# EAGLE design terminal-r1 (EAGLE 4.16)
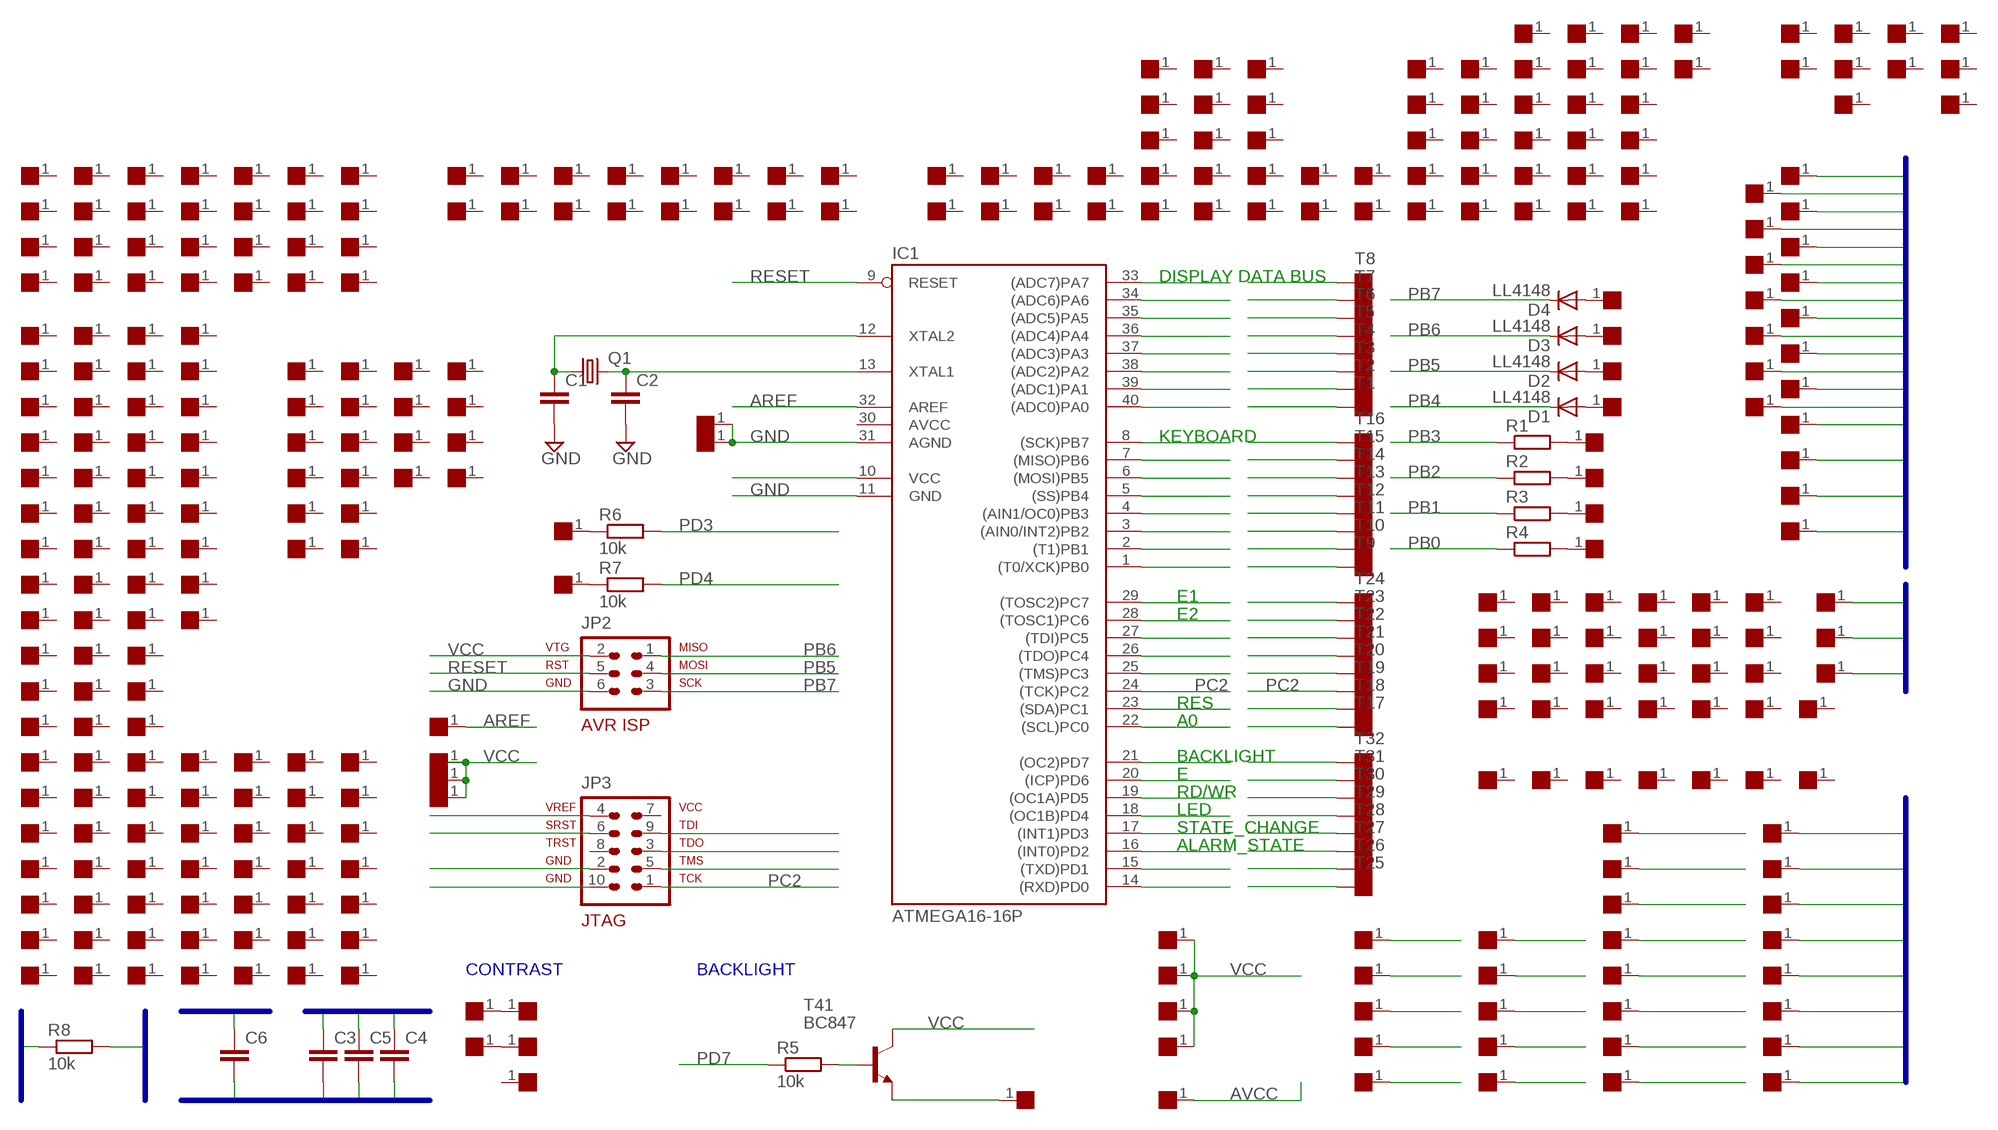
[diagram p0: schematic, sheet 1]

## Parts
C1  C-EUC0805  [C0805]
C2  C-EUC0805  [C0805]
C3  C-EUC1206  [C1206]
C4  C-EUC1210  [C1210]
C5  C-EUC1206  [C1206]
C6  C-EUC1206  [C1206]
D1  LL4148  [MINIMELF]
D2  LL4148  [MINIMELF]
D3  LL4148  [MINIMELF]
D4  LL4148  [MINIMELF]
IC1  ATMEGA16-16P  [DIL40]
JP2  AVR-ISP-6  [AVR-ISP-6]
JP3  AVR-JTAG-10  [AVR-JTAG-10]
Q1  CRYSTALHC49S  [HC49/S]
R1  R-EU_M0805  [M0805]
R2  R-EU_M0805  [M0805]
R3  R-EU_M0805  [M0805]
R4  R-EU_M0805  [M0805]
R5  10k  R-EU_M0805  [M0805]
R6  10k  R-EU_M0805  [M0805]
R7  10k  R-EU_M0805  [M0805]
R8  10k  R-EU_M0805  [M0805]
T1  TESTPOINT  [TESTPOIN]
T2  TESTPOINT  [TESTPOIN]
T3  TESTPOINT  [TESTPOIN]
T4  TESTPOINT  [TESTPOIN]
T5  TESTPOINT  [TESTPOIN]
T6  TESTPOINT  [TESTPOIN]
T7  TESTPOINT  [TESTPOIN]
T8  TESTPOINT  [TESTPOIN]
T9  TESTPOINT  [TESTPOIN]
T10  TESTPOINT  [TESTPOIN]
T11  TESTPOINT  [TESTPOIN]
T12  TESTPOINT  [TESTPOIN]
T13  TESTPOINT  [TESTPOIN]
T14  TESTPOINT  [TESTPOIN]
T15  TESTPOINT  [TESTPOIN]
T16  TESTPOINT  [TESTPOIN]
T17  TESTPOINT  [TESTPOIN]
T18  TESTPOINT  [TESTPOIN]
T19  TESTPOINT  [TESTPOIN]
T20  TESTPOINT  [TESTPOIN]
T21  TESTPOINT  [TESTPOIN]
T22  TESTPOINT  [TESTPOIN]
T23  TESTPOINT  [TESTPOIN]
T24  TESTPOINT  [TESTPOIN]
T25  TESTPOINT  [TESTPOIN]
T26  TESTPOINT  [TESTPOIN]
T27  TESTPOINT  [TESTPOIN]
T28  TESTPOINT  [TESTPOIN]
T29  TESTPOINT  [TESTPOIN]
T30  TESTPOINT  [TESTPOIN]
T31  TESTPOINT  [TESTPOIN]
T32  TESTPOINT  [TESTPOIN]
T33  TESTPOINT  [TESTPOIN]
T34  TESTPOINT  [TESTPOIN]
T35  TESTPOINT  [TESTPOIN]
T36  TESTPOINT  [TESTPOIN]
T37  TESTPOINT  [TESTPOIN]
T38  TESTPOINT  [TESTPOIN]
T39  TESTPOINT  [TESTPOIN]
T40  TESTPOINT  [TESTPOIN]
T41  BC847  [SOT23]
T42  TESTPOINT  [TESTPOIN]
T43  TESTPOINT  [TESTPOIN]
T44  TESTPOINT  [TESTPOIN]
T45  TESTPOINT  [TESTPOIN]
T46  TESTPOINT  [TESTPOIN]
T47  TESTPOINT  [TESTPOIN]
T48  TESTPOINT  [TESTPOIN]
T49  TESTPOINT  [TESTPOIN]
T50  TESTPOINT  [TESTPOIN]
T51  TESTPOINT  [TESTPOIN]
T52  TESTPOINT  [TESTPOIN]
T53  TESTPOINT  [TESTPOIN]
T54  TESTPOINT  [TESTPOIN]
T55  TESTPOINT  [TESTPOIN]
T56  TESTPOINT  [TESTPOIN]
T57  TESTPOINT  [TESTPOIN]
T58  TESTPOINT  [TESTPOIN]
T59  TESTPOINT  [TESTPOIN]
T60  TESTPOINT  [TESTPOIN]
T61  TESTPOINT  [TESTPOIN]
T62  TESTPOINT  [TESTPOIN]
T63  TESTPOINT  [TESTPOIN]
T64  TESTPOINT  [TESTPOIN]
T65  TESTPOINT  [TESTPOIN]
T66  TESTPOINT  [TESTPOIN]
T67  TESTPOINT  [TESTPOIN]
T68  TESTPOINT  [TESTPOIN]
T69  TESTPOINT  [TESTPOIN]
T70  TESTPOINT  [TESTPOIN]
T71  TESTPOINT  [TESTPOIN]
T72  TESTPOINT  [TESTPOIN]
T73  TESTPOINT  [TESTPOIN]
T74  TESTPOINT  [TESTPOIN]
T75  TESTPOINT  [TESTPOIN]
T76  TESTPOINT  [TESTPOIN]
T77  TESTPOINT  [TESTPOIN]
T78  TESTPOINT  [TESTPOIN]
T79  TESTPOINT  [TESTPOIN]
T80  TESTPOINT  [TESTPOIN]
T81  TESTPOINT  [TESTPOIN]
T82  TESTPOINT  [TESTPOIN]
T83  TESTPOINT  [TESTPOIN]
T84  TESTPOINT  [TESTPOIN]
T85  TESTPOINT  [TESTPOIN]
T86  TESTPOINT  [TESTPOIN]
T87  TESTPOINT  [TESTPOIN]
T88  TESTPOINT  [TESTPOIN]
T89  TESTPOINT  [TESTPOIN]
T90  TESTPOINT  [TESTPOIN]
T91  TESTPOINT  [TESTPOIN]
T92  TESTPOINT  [TESTPOIN]
T93  TESTPOINT  [TESTPOIN]
T94  TESTPOINT  [TESTPOIN]
T95  TESTPOINT  [TESTPOIN]
T96  TESTPOINT  [TESTPOIN]
T97  TESTPOINT  [TESTPOIN]
T98  TESTPOINT  [TESTPOIN]
T99  TESTPOINT  [TESTPOIN]
T100  TESTPOINT  [TESTPOIN]
T101  TESTPOINT  [TESTPOIN]
T102  TESTPOINT  [TESTPOIN]
T103  TESTPOINT  [TESTPOIN]
T104  TESTPOINT  [TESTPOIN]
T105  TESTPOINT  [TESTPOIN]
T106  TESTPOINT  [TESTPOIN]
T107  TESTPOINT  [TESTPOIN]
T108  TESTPOINT  [TESTPOIN]
T109  TESTPOINT  [TESTPOIN]
T110  TESTPOINT  [TESTPOIN]
T111  TESTPOINT  [TESTPOIN]
T112  TESTPOINT  [TESTPOIN]
T113  TESTPOINT  [TESTPOIN]
T114  TESTPOINT  [TESTPOIN]
T115  TESTPOINT  [TESTPOIN]
T116  TESTPOINT  [TESTPOIN]
T117  TESTPOINT  [TESTPOIN]
T118  TESTPOINT  [TESTPOIN]
T119  TESTPOINT  [TESTPOIN]
T120  TESTPOINT  [TESTPOIN]
T121  TESTPOINT  [TESTPOIN]
T122  TESTPOINT  [TESTPOIN]
T123  TESTPOINT  [TESTPOIN]
T124  TESTPOINT  [TESTPOIN]
T125  TESTPOINT  [TESTPOIN]
T126  TESTPOINT  [TESTPOIN]
T127  TESTPOINT  [TESTPOIN]
T128  TESTPOINT  [TESTPOIN]
T129  TESTPOINT  [TESTPOIN]
T130  TESTPOINT  [TESTPOIN]
T131  TESTPOINT  [TESTPOIN]
T132  TESTPOINT  [TESTPOIN]
T133  TESTPOINT  [TESTPOIN]
T134  TESTPOINT  [TESTPOIN]
T135  TESTPOINT  [TESTPOIN]
T136  TESTPOINT  [TESTPOIN]
T137  TESTPOINT  [TESTPOIN]
T138  TESTPOINT  [TESTPOIN]
T139  TESTPOINT  [TESTPOIN]
T140  TESTPOINT  [TESTPOIN]
T141  TESTPOINT  [TESTPOIN]
T142  TESTPOINT  [TESTPOIN]
T143  TESTPOINT  [TESTPOIN]
T144  TESTPOINT  [TESTPOIN]
T145  TESTPOINT  [TESTPOIN]
T146  TESTPOINT  [TESTPOIN]
T147  TESTPOINT  [TESTPOIN]
T148  TESTPOINT  [TESTPOIN]
T149  TESTPOINT  [TESTPOIN]
T150  TESTPOINT  [TESTPOIN]
T151  TESTPOINT  [TESTPOIN]
T152  TESTPOINT  [TESTPOIN]
T153  TESTPOINT  [TESTPOIN]
T154  TESTPOINT  [TESTPOIN]
T155  TESTPOINT  [TESTPOIN]
T156  TESTPOINT  [TESTPOIN]
T157  TESTPOINT  [TESTPOIN]
T158  TESTPOINT  [TESTPOIN]
T159  TESTPOINT  [TESTPOIN]
T160  TESTPOINT  [TESTPOIN]
T161  TESTPOINT  [TESTPOIN]
T162  TESTPOINT  [TESTPOIN]
T163  TESTPOINT  [TESTPOIN]
T164  TESTPOINT  [TESTPOIN]
T165  TESTPOINT  [TESTPOIN]
T166  TESTPOINT  [TESTPOIN]
T167  TESTPOINT  [TESTPOIN]
T168  TESTPOINT  [TESTPOIN]
T169  TESTPOINT  [TESTPOIN]
T170  TESTPOINT  [TESTPOIN]
T171  TESTPOINT  [TESTPOIN]
T172  TESTPOINT  [TESTPOIN]
T173  TESTPOINT  [TESTPOIN]
T174  TESTPOINT  [TESTPOIN]
T175  TESTPOINT  [TESTPOIN]
T176  TESTPOINT  [TESTPOIN]
T177  TESTPOINT  [TESTPOIN]
T178  TESTPOINT  [TESTPOIN]
T179  TESTPOINT  [TESTPOIN]
T180  TESTPOINT  [TESTPOIN]
T181  TESTPOINT  [TESTPOIN]
T182  TESTPOINT  [TESTPOIN]
T183  TESTPOINT  [TESTPOIN]
T184  TESTPOINT  [TESTPOIN]
T185  TESTPOINT  [TESTPOIN]
T186  TESTPOINT  [TESTPOIN]
T187  TESTPOINT  [TESTPOIN]
T188  TESTPOINT  [TESTPOIN]
T189  TESTPOINT  [TESTPOIN]
T190  TESTPOINT  [TESTPOIN]
T191  TESTPOINT  [TESTPOIN]
T192  TESTPOINT  [TESTPOIN]
T193  TESTPOINT  [TESTPOIN]
T194  TESTPOINT  [TESTPOIN]
T195  TESTPOINT  [TESTPOIN]
T196  TESTPOINT  [TESTPOIN]
T197  TESTPOINT  [TESTPOIN]
T198  TESTPOINT  [TESTPOIN]
T199  TESTPOINT  [TESTPOIN]
T200  TESTPOINT  [TESTPOIN]
T201  TESTPOINT  [TESTPOIN]
T202  TESTPOINT  [TESTPOIN]
T203  TESTPOINT  [TESTPOIN]
T204  TESTPOINT  [TESTPOIN]
T205  TESTPOINT  [TESTPOIN]
T206  TESTPOINT  [TESTPOIN]
T207  TESTPOINT  [TESTPOIN]
T208  TESTPOINT  [TESTPOIN]
T209  TESTPOINT  [TESTPOIN]
T210  TESTPOINT  [TESTPOIN]
T211  TESTPOINT  [TESTPOIN]
T212  TESTPOINT  [TESTPOIN]
T213  TESTPOINT  [TESTPOIN]
T214  TESTPOINT  [TESTPOIN]
T215  TESTPOINT  [TESTPOIN]
T216  TESTPOINT  [TESTPOIN]
T217  TESTPOINT  [TESTPOIN]
T218  TESTPOINT  [TESTPOIN]
T219  TESTPOINT  [TESTPOIN]
T220  TESTPOINT  [TESTPOIN]
T221  TESTPOINT  [TESTPOIN]
T222  TESTPOINT  [TESTPOIN]
T223  TESTPOINT  [TESTPOIN]
T224  TESTPOINT  [TESTPOIN]
T225  TESTPOINT  [TESTPOIN]
T226  TESTPOINT  [TESTPOIN]
T227  TESTPOINT  [TESTPOIN]
T228  TESTPOINT  [TESTPOIN]
T229  TESTPOINT  [TESTPOIN]
T230  TESTPOINT  [TESTPOIN]
T231  TESTPOINT  [TESTPOIN]
T232  TESTPOINT  [TESTPOIN]
T233  TESTPOINT  [TESTPOIN]
T234  TESTPOINT  [TESTPOIN]
T235  TESTPOINT  [TESTPOIN]
T236  TESTPOINT  [TESTPOIN]
T237  TESTPOINT  [TESTPOIN]
T238  TESTPOINT  [TESTPOIN]
T239  TESTPOINT  [TESTPOIN]
T240  TESTPOINT  [TESTPOIN]
T241  TESTPOINT  [TESTPOIN]
T242  TESTPOINT  [TESTPOIN]
T243  TESTPOINT  [TESTPOIN]
T244  TESTPOINT  [TESTPOIN]
T245  TESTPOINT  [TESTPOIN]
T246  TESTPOINT  [TESTPOIN]
T247  TESTPOINT  [TESTPOIN]
T248  TESTPOINT  [TESTPOIN]
T249  TESTPOINT  [TESTPOIN]
T250  TESTPOINT  [TESTPOIN]
T251  TESTPOINT  [TESTPOIN]
T252  TESTPOINT  [TESTPOIN]
T253  TESTPOINT  [TESTPOIN]
T254  TESTPOINT  [TESTPOIN]
T255  TESTPOINT  [TESTPOIN]
T256  TESTPOINT  [TESTPOIN]
T257  TESTPOINT  [TESTPOIN]
T258  TESTPOINT  [TESTPOIN]
T259  TESTPOINT  [TESTPOIN]
T260  TESTPOINT  [TESTPOIN]
T261  TESTPOINT  [TESTPOIN]
T262  TESTPOINT  [TESTPOIN]
T263  TESTPOINT  [TESTPOIN]
T264  TESTPOINT  [TESTPOIN]
T265  TESTPOINT  [TESTPOIN]
T266  TESTPOINT  [TESTPOIN]
T267  TESTPOINT  [TESTPOIN]
T268  TESTPOINT  [TESTPOIN]
T269  TESTPOINT  [TESTPOIN]
T270  TESTPOINT  [TESTPOIN]
T271  TESTPOINT  [TESTPOIN]
T272  TESTPOINT  [TESTPOIN]
T273  TESTPOINT  [TESTPOIN]
T274  TESTPOINT  [TESTPOIN]
T275  TESTPOINT  [TESTPOIN]
T276  TESTPOINT  [TESTPOIN]
T277  TESTPOINT  [TESTPOIN]
T278  TESTPOINT  [TESTPOIN]
T279  TESTPOINT  [TESTPOIN]
T280  TESTPOINT  [TESTPOIN]
T281  TESTPOINT  [TESTPOIN]
T282  TESTPOINT  [TESTPOIN]
T283  TESTPOINT  [TESTPOIN]
T284  TESTPOINT  [TESTPOIN]
T285  TESTPOINT  [TESTPOIN]
T286  TESTPOINT  [TESTPOIN]
T287  TESTPOINT  [TESTPOIN]
T288  TESTPOINT  [TESTPOIN]
T289  TESTPOINT  [TESTPOIN]
T290  TESTPOINT  [TESTPOIN]
T291  TESTPOINT  [TESTPOIN]
T292  TESTPOINT  [TESTPOIN]
T293  TESTPOINT  [TESTPOIN]
T294  TESTPOINT  [TESTPOIN]
T295  TESTPOINT  [TESTPOIN]
T296  TESTPOINT  [TESTPOIN]
T297  TESTPOINT  [TESTPOIN]
T298  TESTPOINT  [TESTPOIN]
T299  TESTPOINT  [TESTPOIN]
T300  TESTPOINT  [TESTPOIN]
T301  TESTPOINT  [TESTPOIN]
T302  TESTPOINT  [TESTPOIN]
T303  TESTPOINT  [TESTPOIN]
T304  TESTPOINT  [TESTPOIN]
T305  TESTPOINT  [TESTPOIN]
T306  TESTPOINT  [TESTPOIN]
T307  TESTPOINT  [TESTPOIN]
T308  TESTPOINT  [TESTPOIN]
T309  TESTPOINT  [TESTPOIN]
T310  TESTPOINT  [TESTPOIN]
T311  TESTPOINT  [TESTPOIN]
T312  TESTPOINT  [TESTPOIN]
T313  TESTPOINT  [TESTPOIN]
T314  TESTPOINT  [TESTPOIN]
T315  TESTPOINT  [TESTPOIN]
T316  TESTPOINT  [TESTPOIN]
T317  TESTPOINT  [TESTPOIN]
T318  TESTPOINT  [TESTPOIN]
T319  TESTPOINT  [TESTPOIN]
T320  TESTPOINT  [TESTPOIN]
T321  TESTPOINT  [TESTPOIN]
T322  TESTPOINT  [TESTPOIN]
T323  TESTPOINT  [TESTPOIN]
T324  TESTPOINT  [TESTPOIN]
T325  TESTPOINT  [TESTPOIN]
T326  TESTPOINT  [TESTPOIN]
T327  TESTPOINT  [TESTPOIN]
T328  TESTPOINT  [TESTPOIN]
T329  TESTPOINT  [TESTPOIN]
T330  TESTPOINT  [TESTPOIN]
T331  TESTPOINT  [TESTPOIN]
T332  TESTPOINT  [TESTPOIN]
T333  TESTPOINT  [TESTPOIN]
T334  TESTPOINT  [TESTPOIN]
T335  TESTPOINT  [TESTPOIN]
T336  TESTPOINT  [TESTPOIN]
T337  TESTPOINT  [TESTPOIN]
T338  TESTPOINT  [TESTPOIN]
T339  TESTPOINT  [TESTPOIN]
T340  TESTPOINT  [TESTPOIN]
T341  TESTPOINT  [TESTPOIN]
T342  TESTPOINT  [TESTPOIN]
T343  TESTPOINT  [TESTPOIN]
T344  TESTPOINT  [TESTPOIN]
T345  TESTPOINT  [TESTPOIN]
T346  TESTPOINT  [TESTPOIN]
T347  TESTPOINT  [TESTPOIN]
T348  TESTPOINT  [TESTPOIN]
T349  TESTPOINT  [TESTPOIN]
T350  TESTPOINT  [TESTPOIN]
T351  TESTPOINT  [TESTPOIN]
T352  TESTPOINT  [TESTPOIN]
T353  TESTPOINT  [TESTPOIN]
T354  TESTPOINT  [TESTPOIN]
T355  TESTPOINT  [TESTPOIN]
T356  TESTPOINT  [TESTPOIN]
T357  TESTPOINT  [TESTPOIN]
T358  TESTPOINT  [TESTPOIN]
T359  TESTPOINT  [TESTPOIN]
T360  TESTPOINT  [TESTPOIN]
T361  TESTPOINT  [TESTPOIN]
T362  TESTPOINT  [TESTPOIN]
T363  TESTPOINT  [TESTPOIN]
T364  TESTPOINT  [TESTPOIN]

## Nets
AREF: IC1.32(AREF) T50.1
AVCC: T52.1
GND: C1.2 C2.2 C3.2 C4.2 C5.2 C6.2 IC1.11(GND) IC1.31(AGND) JP2.6 JP3.2 JP3.10 T54.1 T55.1 T328.1 T329.1 T330.1 T331.1 T332.1 T333.1 T334.1 T335.1 T336.1 T337.1 T338.1 T339.1 T340.1 T341.1 T342.1 T343.1 T362.1 T363.1 T364.1
N$1: D4.A T33.1
N$2: D3.A T34.1
N$3: D2.A T35.1
N$4: D1.A T36.1
N$5: R1.2 T37.1
N$6: R2.2 T38.1
N$7: R3.2 T39.1
N$8: R4.2 T40.1
N$9: R5.2 T41.1(B)
N$10: T41.2(E) T42.1
N$11: T43.1 T45.1
N$12: T46.1 T48.1
N$13: R7.1 T49.1
N$14: R6.1 T44.1
N$15: C2.1 IC1.13(XTAL1) Q1.2
N$16: C1.1 IC1.12(XTAL2) Q1.1
PA0: IC1.40((ADC0)PA0) T1.1
PA1: IC1.39((ADC1)PA1) T2.1
PA2: IC1.38((ADC2)PA2) T3.1
PA3: IC1.37((ADC3)PA3) T4.1
PA4: IC1.36((ADC4)PA4) T5.1
PA5: IC1.35((ADC5)PA5) T6.1
PA6: IC1.34((ADC6)PA6) T7.1
PA7: IC1.33((ADC7)PA7) T8.1
PB0: IC1.1((T0/XCK)PB0) R4.1 T9.1
PB1: IC1.2((T1)PB1) R3.1 T10.1
PB2: IC1.3((AIN0/INT2)PB2) R2.1 T11.1
PB3: IC1.4((AIN1/OC0)PB3) R1.1 T12.1
PB4: D1.C IC1.5((SS)PB4) T13.1
PB5: D2.C IC1.6((MOSI)PB5) JP2.4 T14.1
PB6: D3.C IC1.7((MISO)PB6) JP2.1 T15.1
PB7: D4.C IC1.8((SCK)PB7) JP2.3 T16.1
PC0: IC1.22((SCL)PC0) T17.1
PC1: IC1.23((SDA)PC1) T18.1
PC2: IC1.24((TCK)PC2) JP3.1 T19.1
PC3: IC1.25((TMS)PC3) JP3.5 T20.1
PC4: IC1.26((TDO)PC4) JP3.3 T21.1
PC5: IC1.27((TDI)PC5) JP3.9 T22.1
PC6: IC1.28((TOSC1)PC6) T23.1
PC7: IC1.29((TOSC2)PC7) T24.1
PD0: IC1.14((RXD)PD0) T25.1
PD1: IC1.15((TXD)PD1) T26.1
PD2: C6.1 IC1.16((INT0)PD2) T27.1
PD3: IC1.17((INT1)PD3) R6.2 T28.1
PD4: IC1.18((OC1B)PD4) R7.2 T29.1
PD5: IC1.19((OC1A)PD5) T30.1
PD6: IC1.20((ICP)PD6) T31.1
PD7: IC1.21((OC2)PD7) R5.1 T32.1
RESET: IC1.9(RESET) JP2.5 JP3.6 R8.2
VCC: C3.1 C4.1 C5.1 IC1.10(VCC) JP2.2 JP3.4 R8.1 T41.3(C) T51.1 T53.1 T56.1 T313.1 T314.1 T315.1 T316.1 T317.1 T318.1 T319.1 T320.1 T321.1 T322.1 T323.1 T324.1 T325.1 T326.1 T344.1 T345.1 T346.1 T347.1 T348.1 T349.1 T350.1 T351.1 T352.1 T353.1 T354.1 T355.1 T356.1 T357.1 T358.1 T359.1 T360.1 T361.1
Unconnected: JP3.7 JP3.8 T47.1 T57.1 T58.1 T59.1 T60.1 T61.1 T62.1 T63.1 T64.1 T65.1 T66.1 T67.1 T68.1 T69.1 T70.1 T71.1 T72.1 T73.1 T74.1 T75.1 T76.1 T77.1 T78.1 T79.1 T80.1 T81.1 T82.1 T83.1 T84.1 T85.1 T86.1 T87.1 T88.1 T89.1 T90.1 T91.1 T92.1 T93.1 T94.1 T95.1 T96.1 T97.1 T98.1 T99.1 T100.1 T101.1 T102.1 T103.1 T104.1 T105.1 T106.1 T107.1 T108.1 T109.1 T110.1 T111.1 T112.1 T113.1 T114.1 T115.1 T116.1 T117.1 T118.1 T119.1 T120.1 T121.1 T122.1 T123.1 T124.1 T125.1 T126.1 T127.1 T128.1 T129.1 T130.1 T131.1 T132.1 T133.1 T134.1 T135.1 T136.1 T137.1 T138.1 T139.1 T140.1 T141.1 T142.1 T143.1 T144.1 T145.1 T146.1 T147.1 T148.1 T149.1 T150.1 T151.1 T152.1 T153.1 T154.1 T155.1 T156.1 T157.1 T158.1 T159.1 T160.1 T161.1 T162.1 T163.1 T164.1 T165.1 T166.1 T167.1 T168.1 T169.1 T170.1 T171.1 T172.1 T173.1 T174.1 T175.1 T176.1 T177.1 T178.1 T179.1 T180.1 T181.1 T182.1 T183.1 T184.1 T185.1 T186.1 T187.1 T188.1 T189.1 T190.1 T191.1 T192.1 T193.1 T194.1 T195.1 T196.1 T197.1 T198.1 T199.1 T200.1 T201.1 T202.1 T203.1 T204.1 T205.1 T206.1 T207.1 T208.1 T209.1 T210.1 T211.1 T212.1 T213.1 T214.1 T215.1 T216.1 T217.1 T218.1 T219.1 T220.1 T221.1 T222.1 T223.1 T224.1 T225.1 T226.1 T227.1 T228.1 T229.1 T230.1 T231.1 T232.1 T233.1 T234.1 T235.1 T236.1 T237.1 T238.1 T239.1 T240.1 T241.1 T242.1 T243.1 T244.1 T245.1 T246.1 T247.1 T248.1 T249.1 T250.1 T251.1 T252.1 T253.1 T254.1 T255.1 T256.1 T257.1 T258.1 T259.1 T260.1 T261.1 T262.1 T263.1 T264.1 T265.1 T266.1 T267.1 T268.1 T269.1 T270.1 T271.1 T272.1 T273.1 T274.1 T275.1 T276.1 T277.1 T278.1 T279.1 T280.1 T281.1 T282.1 T283.1 T284.1 T285.1 T286.1 T287.1 T288.1 T289.1 T290.1 T291.1 T292.1 T293.1 T294.1 T295.1 T296.1 T297.1 T298.1 T299.1 T300.1 T301.1 T302.1 T303.1 T304.1 T305.1 T306.1 T307.1 T308.1 T309.1 T310.1 T311.1 T312.1 T327.1

## Buses
GND
VCC
PD[0..7]
RESET

## Notes on the sheet
- DISPLAY DATA BUS
- KEYBOARD
- E1
- E2
- RES
- A0
- BACKLIGHT
- E
- RD/WR
- LED
- STATE_CHANGE
- ALARM_STATE
- CONTRAST | BACKLIGHT

## Power pins joined to a net without a drawn wire
AVCC: IC1.30(AVCC)

## Library data of the parts
C1-C6 = rcl:C-EU: CAPACITOR, European symbol
D1-D4 = diode-os:LL4148
IC1 = avr:ATMEGA16*P: MICROCONTROLLER 16 Kbytes FLASH 1 kbytes SRAM 512 bytes EEPROM USART 8-channel 10 bit ADC
JP2 = atmel-another:AVR-ISP-6: AVR ISP-6 Serial Programming Header
JP3 = atmel-another:AVR-JTAG-10: AVR JTAG Debug/Programming Header
Q1 = crystal:CRYSTAL: CRYSTAL
R1-R8 = rcl:R-EU_: RESISTOR, European symbol
T1-T32 = ads4:TESTPOINT: Test point
T33-T40 T42-T364 = ADS:TESTPOINT
T41 = transistor:BC847: NPN TRANSISTOR

## Board
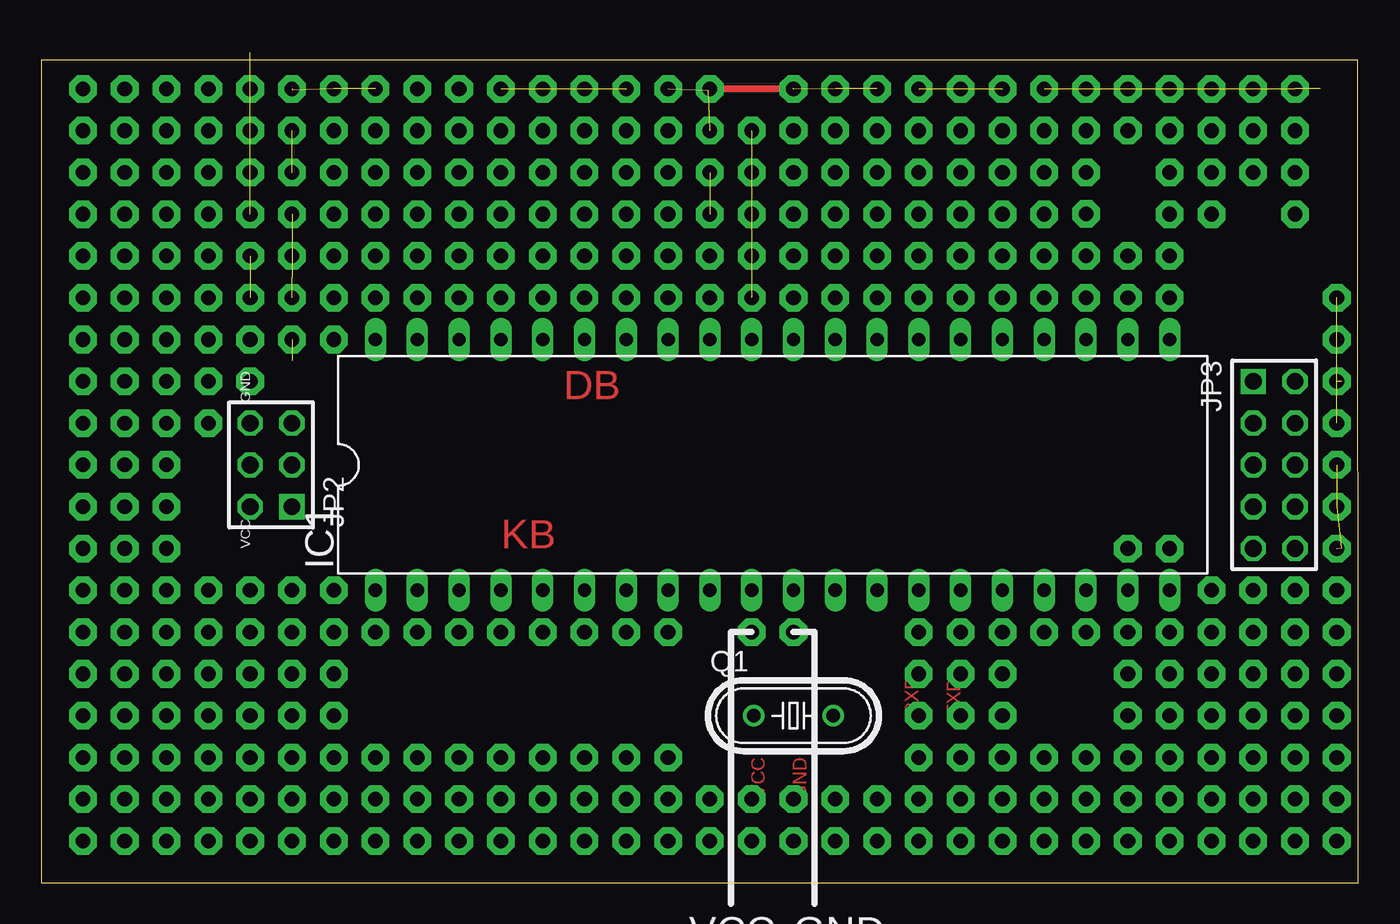
[diagram p1: board, top side]
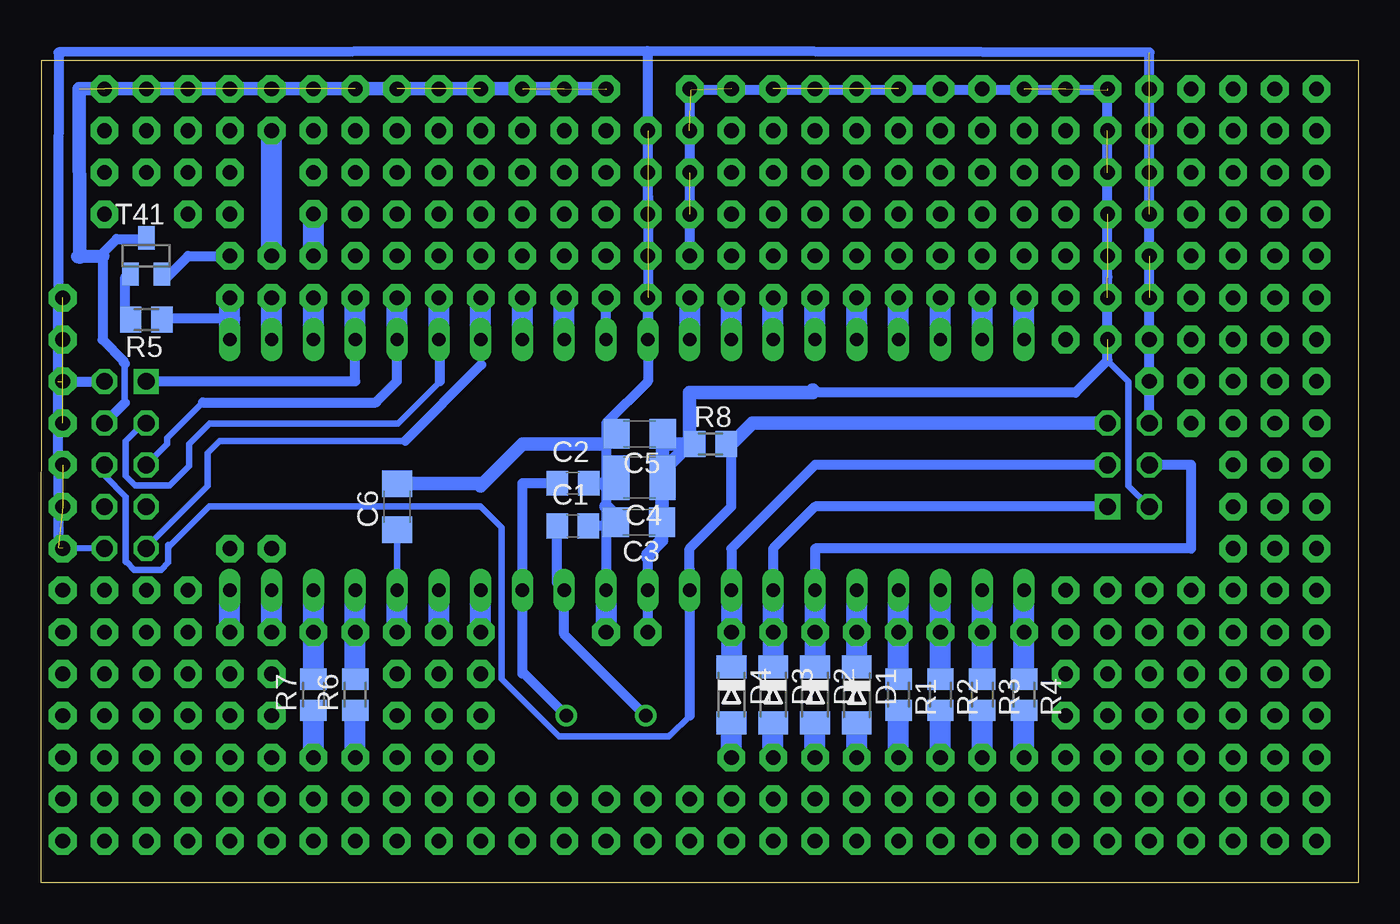
[diagram p2: board, bottom side, seen from below]

Size 80.05 x 50.01 mm. Coordinates in mm from the lower left corner, seen from the top.
Outline: 0,0 80.05,0 80,50.01 0,50 0,0
Copper layers (1*16): Top 0.035mm / dielectric 1.5mm / Bottom 0.035mm
Design rules "default": minimum track width 10mil, minimum drill 24mil, track to track 8mil, track to pad 8mil, pad to pad 8mil, via to via 8mil, smd to smd 8mil, copper to edge 40mil, drill to drill 8mil, minimum pad ring 10mil, minimum via ring 8mil, stop-mask expansion 4mil, vias tented up to drill 0mil, thermal gap 10mil

### Footprints (pad centres in the part's own frame; a part is rotated, then mirrored left to right if it is on the bottom)
C0805 = smd 1.3 x 1.5: 1 -0.95,0; 2 0.95,0
C1206 = smd 1.6 x 1.8: 1 -1.4,0; 2 1.4,0
C1210 = smd 1.6 x 2.7: 1 -1.4,0; 2 1.4,0
MINIMELF = smd 1.4 x 1.8: A 1.7,0; C -1.7,0
DIL40 = drill 0.813 long: 1 -24.13,-7.62; 2 -21.59,-7.62; 3 -19.05,-7.62; 4 -16.51,-7.62; 5 -13.97,-7.62; 6 -11.43,-7.62; 7 -8.89,-7.62; 8 -6.35,-7.62; 9 -3.81,-7.62; 10 -1.27,-7.62; 11 1.27,-7.62; 12 3.81,-7.62; 13 6.35,-7.62; 14 8.89,-7.62; 15 11.43,-7.62; 16 13.97,-7.62; 17 16.51,-7.62; 18 19.05,-7.62; 19 21.59,-7.62; 20 24.13,-7.62; 21 24.13,7.62; 22 21.59,7.62; 23 19.05,7.62; 24 16.51,7.62; 25 13.97,7.62; 26 11.43,7.62; 27 8.89,7.62; 28 6.35,7.62; 29 3.81,7.62; 30 1.27,7.62; 31 -1.27,7.62; 32 -3.81,7.62; 33 -6.35,7.62; 34 -8.89,7.62; 35 -11.43,7.62; 36 -13.97,7.62; 37 -16.51,7.62; 38 -19.05,7.62; 39 -21.59,7.62; 40 -24.13,7.62
AVR-ISP-6 = drill 1.016 square: 1 -2.54,-1.27 | drill 1.016 octagon: 2 -2.54,1.27; 3 0,-1.27; 4 0,1.27; 5 2.54,-1.27; 6 2.54,1.27
AVR-JTAG-10 = drill 1.016 square: 1 -5.08,-1.27 | drill 1.016 octagon: 2 -5.08,1.27; 3 -2.54,-1.27; 4 -2.54,1.27; 5 0,-1.27; 6 0,1.27; 7 2.54,-1.27; 8 2.54,1.27; 9 5.08,-1.27; 10 5.08,1.27
HC49/S = drill 0.813 round: 1 -2.413,0; 2 2.413,0
M0805 = smd 1.3 x 1.6: 1 -0.95,0; 2 0.95,0
TESTPOIN = drill 0.889 pad 1.676 octagon: 1 0,0
SOT23 = smd 1 x 1.4: 1 -0.95,-1.1; 2 0.95,-1.1; 3 0,1.1

### Placement (x,y rotation side)
C1  47.74,21.69 0 bottom
C2  47.73,24.29 0 bottom
C3  43.72,21.92 180 bottom
C4  43.69,24.63 180 bottom
C5  43.68,27.29 180 bottom
C6  58.42,22.86 90 bottom
D1  30.48,11.42 270 bottom
D2  33.02,11.43 270 bottom
D3  35.56,11.43 270 bottom
D4  38.1,11.43 270 bottom
IC1  44.45,25.4 0 top
JP2  13.97,25.4 90 top
JP3  74.93,25.4 270 top
Q1  45.72,10.16 0 top
R1  27.94,11.43 270 bottom
R2  25.4,11.43 270 bottom
R3  22.86,11.43 270 bottom
R4  20.32,11.43 270 bottom
R5  73.66,34.23 180 bottom
R6  60.96,11.43 90 bottom
R7  63.5,11.43 90 bottom
R8  39.37,26.67 0 bottom
T1  20.32,35.56 0 bottom
T2  22.86,35.56 0 top
T3  25.4,35.56 0 top
T4  27.94,35.56 0 top
T5  30.48,35.56 0 top
T6  33.02,35.56 0 top
T7  35.56,35.56 0 top
T8  38.1,35.56 0 top
T9  20.32,15.24 0 top
T10  22.86,15.24 0 top
T11  25.4,15.24 0 top
T12  27.94,15.24 0 top
T13  30.48,15.24 0 top
T14  33.02,15.24 0 top
T15  35.56,15.24 0 top
T16  38.1,15.24 0 top
T17  66.04,35.56 0 top
T18  63.5,35.56 0 top
T19  60.96,35.56 0 top
T20  58.42,35.56 0 top
T21  55.88,35.56 0 top
T22  53.34,35.56 0 top
T23  50.8,35.56 0 top
T24  48.26,35.56 0 top
T25  53.34,15.24 0 top
T26  55.88,15.24 0 top
T27  58.42,15.24 0 top
T28  60.96,15.24 0 top
T29  63.5,15.24 0 top
T30  66.04,15.24 0 top
T31  68.58,15.24 0 top
T32  68.58,35.56 0 top
T33  38.1,7.62 0 top
T34  35.56,7.62 0 top
T35  33.02,7.62 0 top
T36  30.48,7.62 0 top
T37  27.94,7.62 0 top
T38  25.4,7.62 0 top
T39  22.86,7.62 0 top
T40  20.32,7.62 0 top
T41  73.66,38.1 0 bottom
T42  68.58,38.1 0 top
T43  66.04,38.1 270 top
T44  60.96,7.62 0 top
T45  66.04,45.72 270 top
T46  63.51,40.65 0 top
T47  68.58,40.64 270 top
T48  63.5,38.1 270 top
T49  63.5,7.62 0 top
T50  40.63,35.56 0 top
T51  40.64,40.64 0 top
T52  45.72,35.56 0 top
T53  40.63,38.1 0 top
T54  43.18,35.56 0 top
T55  45.72,15.24 0 top
T56  43.18,15.24 0 top
T57  2.54,48.26 0 top
T58  5.08,48.26 0 top
T59  7.62,48.26 0 top
T60  10.16,48.26 0 top
T61  2.54,45.72 0 top
T62  5.08,45.72 0 top
T63  10.16,45.72 0 top
T64  7.62,45.72 0 top
T65  2.54,43.18 0 top
T66  5.08,43.18 0 top
T67  7.62,43.18 0 top
T68  10.16,43.18 0 top
T69  2.54,40.64 0 top
T70  5.08,40.64 0 top
T71  7.62,40.64 0 top
T72  10.16,40.64 0 top
T73  2.54,38.1 0 top
T74  5.08,38.1 0 top
T75  7.62,38.1 0 top
T76  10.16,38.1 0 top
T77  2.54,35.56 0 top
T78  5.08,35.56 0 top
T79  7.62,35.56 0 top
T80  10.16,35.56 0 top
T81  2.54,33.02 0 top
T82  5.08,33.02 0 top
T83  7.62,33.02 0 top
T84  10.16,33.02 0 top
T85  2.54,30.48 0 top
T86  5.08,30.48 0 top
T87  7.62,30.48 0 top
T88  10.16,30.48 0 top
T89  2.54,27.94 0 top
T90  5.08,27.94 0 top
T91  7.62,27.94 0 top
T92  10.16,27.94 0 top
T93  2.54,25.4 0 top
T94  5.08,25.4 0 top
T95  7.62,25.4 0 top
T96  2.54,17.78 0 top
T97  2.54,22.86 0 top
T98  5.08,22.86 0 top
T99  7.62,22.86 0 top
T100  5.08,17.78 0 top
T101  2.54,20.32 0 top
T102  5.08,20.32 0 top
T103  7.62,20.32 0 top
T104  7.62,17.78 0 top
T105  10.16,17.78 0 top
T106  2.54,15.24 0 top
T107  5.08,15.24 0 top
T108  7.62,15.24 0 top
T109  10.16,15.24 0 top
T110  2.54,12.7 0 top
T111  5.08,12.7 0 top
T112  7.62,12.7 0 top
T113  10.16,12.7 0 top
T114  2.54,10.16 0 top
T115  5.08,10.16 0 top
T116  7.62,10.16 0 top
T117  10.16,10.16 0 top
T118  2.54,7.62 0 top
T119  5.08,7.62 0 top
T120  7.62,7.62 0 top
T121  10.16,7.62 0 top
T122  2.54,5.08 0 top
T123  5.08,5.08 0 top
T124  7.62,5.08 0 top
T125  10.16,5.08 0 top
T126  2.54,2.54 0 top
T127  5.08,2.54 0 top
T128  7.62,2.54 0 top
T129  10.16,2.54 0 top
T130  12.7,2.54 0 top
T131  15.24,2.54 0 top
T132  17.78,2.54 0 top
T133  12.7,5.08 0 top
T134  15.24,5.08 0 top
T135  17.78,5.08 0 top
T136  12.7,7.62 0 top
T137  15.24,7.62 0 top
T138  17.78,7.62 0 top
T139  12.7,10.16 0 top
T140  15.24,10.16 0 top
T141  17.78,10.16 0 top
T142  12.7,12.7 0 top
T143  15.24,12.7 0 top
T144  17.78,12.7 0 top
T145  12.7,15.24 0 top
T146  15.24,15.24 0 top
T147  17.78,15.24 0 top
T148  12.7,17.78 0 top
T149  15.24,17.78 0 top
T150  17.78,17.78 0 top
T151  78.74,15.24 0 top
T152  78.74,12.7 0 top
T153  78.74,10.16 0 top
T154  78.74,7.62 0 top
T155  17.78,45.72 0 top
T156  17.78,43.18 0 top
T157  17.78,40.64 0 top
T158  17.78,38.1 0 top
T159  78.74,5.08 0 top
T160  17.78,35.56 0 top
T161  78.74,2.54 0 top
T162  17.78,33.02 0 top
T163  20.32,45.72 0 top
T164  20.32,43.18 0 top
T165  20.32,40.64 0 top
T166  20.32,38.1 0 top
T167  22.86,45.72 0 top
T168  22.86,43.18 0 top
T169  25.4,45.72 0 top
T170  27.94,45.72 0 top
T171  30.48,45.72 0 top
T172  33.02,45.72 0 top
T173  22.86,40.64 0 top
T174  22.86,38.1 0 top
T175  25.4,43.18 0 top
T176  25.4,40.64 0 top
T177  25.4,38.1 0 top
T178  27.94,43.18 0 top
T179  35.56,45.72 0 top
T180  38.1,45.72 0 top
T181  40.64,2.54 0 top
T182  27.94,40.64 0 top
T183  45.72,43.18 0 top
T184  45.72,40.64 0 top
T185  45.72,38.1 0 top
T186  38.1,38.1 0 top
T187  27.94,38.1 0 top
T188  30.48,38.1 0 top
T189  33.02,38.1 0 top
T190  35.56,38.1 0 top
T191  30.48,43.18 0 top
T192  30.48,40.64 0 top
T193  33.02,43.18 0 top
T194  33.02,40.64 0 top
T195  35.56,40.64 0 top
T196  35.56,43.18 0 top
T197  38.1,43.18 0 top
T198  38.1,40.64 0 top
T199  20.32,5.08 0 top
T200  22.86,5.08 0 top
T201  25.4,5.08 0 top
T202  27.94,5.08 0 top
T203  30.48,5.08 0 top
T204  33.02,5.08 0 top
T205  35.56,5.08 0 top
T206  38.1,5.08 0 top
T207  20.32,2.54 0 top
T208  22.86,2.54 0 top
T209  25.4,2.54 0 top
T210  27.94,2.54 0 top
T211  30.48,2.54 0 top
T212  33.02,2.54 0 top
T213  35.56,2.54 0 top
T214  38.1,2.54 0 top
T215  43.18,5.08 0 top
T216  45.72,5.08 0 top
T217  48.26,5.08 0 top
T218  50.8,5.08 0 top
T219  53.34,5.08 0 top
T220  55.88,5.08 0 top
T221  58.42,5.08 0 top
T222  60.96,5.08 0 top
T223  63.5,5.08 0 top
T224  66.04,5.08 0 top
T225  68.58,5.08 0 top
T226  71.12,5.08 0 top
T227  76.2,5.08 0 top
T228  73.66,5.08 0 top
T229  43.18,2.54 0 top
T230  45.72,2.54 0 top
T231  48.26,2.54 0 top
T232  50.8,2.54 0 top
T233  53.34,2.54 0 top
T234  55.88,2.54 0 top
T235  58.42,2.54 0 top
T236  60.96,2.54 0 top
T237  63.5,2.54 0 top
T238  66.04,2.54 0 top
T239  68.58,2.54 0 top
T240  71.12,2.54 0 top
T241  73.66,2.54 0 top
T242  76.2,2.54 0 top
T243  76.2,7.62 0 top
T244  76.2,10.16 0 top
T245  76.2,12.7 0 top
T246  76.2,15.24 0 top
T247  73.66,15.24 0 top
T248  71.12,15.24 0 top
T249  71.12,12.7 0 top
T250  73.66,12.7 0 top
T251  73.66,10.16 0 top
T252  73.66,7.62 0 top
T253  71.12,7.62 0 top
T254  71.12,10.16 0 top
T255  66.04,12.7 0 top
T256  66.04,10.16 0 top
T257  66.04,7.62 0 top
T258  68.58,7.62 0 top
T259  68.58,10.16 0 top
T260  68.58,12.7 0 top
T261  58.42,7.62 0 top
T262  55.88,7.62 0 top
T263  53.34,7.62 0 top
T264  53.34,10.16 0 top
T265  55.88,10.16 0 top
T266  58.42,10.16 0 top
T267  58.42,12.7 0 top
T268  55.88,12.7 0 top
T269  53.34,12.7 0 top
T270  48.26,45.72 0 top
T271  48.26,43.18 0 top
T272  48.26,40.64 0 top
T273  48.26,38.1 0 top
T274  50.8,45.72 0 top
T275  50.8,43.18 0 top
T276  50.8,40.64 0 top
T277  50.8,38.1 0 top
T278  53.34,45.72 0 top
T279  55.88,45.72 0 top
T280  58.42,45.72 0 top
T281  60.96,45.72 0 top
T282  53.34,43.18 0 top
T283  53.34,40.64 0 top
T284  53.34,38.1 0 top
T285  55.88,43.18 0 top
T286  55.88,40.64 0 top
T287  55.88,38.1 0 top
T288  58.42,43.18 0 top
T289  58.42,40.64 0 top
T290  60.96,43.18 0 top
T291  58.42,38.1 0 top
T292  60.96,38.1 0 top
T293  60.96,40.64 0 top
T294  63.5,45.72 0 top
T295  63.5,43.18 0 top
T296  68.58,45.72 0 top
T297  68.58,43.18 0 top
T298  71.12,45.72 0 top
T299  73.66,45.72 0 top
T300  76.2,45.72 0 top
T301  71.12,43.18 0 top
T302  73.66,43.18 0 top
T303  76.2,43.18 0 top
T304  71.12,40.64 0 top
T305  76.2,40.64 0 top
T306  71.12,17.78 0 top
T307  73.66,17.78 0 top
T308  76.2,17.78 0 top
T309  78.74,17.78 0 top
T310  45.72,45.72 0 top
T311  66.04,20.32 0 top
T312  68.58,20.32 0 top
T313  40.64,48.26 0 top
T314  45.72,48.26 0 top
T315  40.64,43.18 0 top
T316  40.64,45.72 0 top
T317  25.4,48.26 0 top
T318  22.86,48.26 0 top
T319  20.32,48.26 0 top
T320  17.78,48.26 0 top
T321  15.24,48.26 0 top
T322  27.94,48.26 0 top
T323  30.48,48.26 0 top
T324  33.02,48.26 0 top
T325  35.56,48.26 0 top
T326  48.26,48.26 0 top
T327  40.64,5.08 0 top
T328  78.74,20.32 0 top
T329  78.74,22.86 0 top
T330  78.74,25.4 0 top
T331  78.74,27.94 0 top
T332  78.74,30.48 0 top
T333  78.74,33.02 0 top
T334  78.74,35.56 0 top
T335  12.7,30.48 0 top
T336  43.18,38.1 0 top
T337  43.18,40.64 0 top
T338  43.18,43.18 0 top
T339  43.18,45.72 0 top
T340  12.7,33.02 0 top
T341  12.7,35.56 0 top
T342  12.7,38.1 0 top
T343  12.7,40.64 0 top
T344  15.24,45.72 0 top
T345  15.24,43.18 0 top
T346  15.24,40.64 0 top
T347  15.24,38.1 0 top
T348  15.24,33.02 0 top
T349  15.24,35.56 0 top
T350  38.1,48.26 0 top
T351  50.8,48.26 0 top
T352  53.34,48.26 0 top
T353  55.88,48.26 0 top
T354  58.42,48.26 0 top
T355  60.96,48.26 0 top
T356  63.5,48.26 0 top
T357  66.04,48.26 0 top
T358  68.58,48.26 0 top
T359  71.12,48.26 0 top
T360  73.66,48.26 0 top
T361  76.2,48.26 0 top
T362  12.7,43.18 0 top
T363  12.7,45.72 0 top
T364  12.7,48.26 0 top

### Tracks (layer width: path | path; a pad name or v marks a point on that pad's centre or on a via)
AREF
  Bottom 1.27: T50.1 IC1.32
AVCC
  Bottom 0.61: IC1.30 T52.1
GND  (16 unrouted)
  Bottom 0.406: IC1.31 43.18,30.48 | 79,20.36 JP3.10 | T340.1 | T340.1 T335.1 | T340.1 T341.1 | 53.34,24.13 53.47,24.26
  Bottom 0.61: T54.1 IC1.31 43.21,50.55 | 43.21,50.55 12.69,50.47 T340.1 JP2.6 | 45.72,24.18 45.72,26.67 45.72,27.94 43.18,30.48 43.21,50.55 | 45.72,24.18 45.72,24.13 45.72,22.86 45.72,21.61 | 45.72,21.61 IC1.11 | 43.21,50.55 78.99,50.48 79.05,30.48 | 79.05,30.48 JP3.2 | 79.05,30.48 79,20.36 | 45.72,24.18 45.76,24.18 45.87,24.29 C2.2 | 45.72,21.61 45.76,21.61 45.84,21.69 C1.2
  Bottom 0.813: C3.2 45.12,22.26 45.72,22.86 | C4.2 45.22,24.63 45.72,24.13 | C5.2 45.1,27.29 45.72,26.67 50.8,26.67 53.34,24.13 | 53.47,24.26 C6.2
  Bottom 1.27: IC1.11 T55.1
N$1
  Bottom 1.27: T33.1 D4.A
N$2
  Bottom 1.27: T34.1 D3.A
N$3
  Bottom 1.27: T35.1 D2.A
N$4
  Bottom 1.27: T36.1 D1.A
N$5
  Bottom 1.27: T37.1 R1.2
N$6
  Bottom 1.27: T38.1 R2.2
N$7
  Bottom 1.27: T39.1 R3.2
N$8
  Bottom 1.27: T40.1 R4.2
N$9
  Bottom 0.254: R5.2 74.93,34.29 | 74.93,36.83 T41.1
  Bottom 0.61: 74.93,34.29 74.93,36.83
N$10
  Bottom 0.254: T41.2 72.39,36.83
  Bottom 0.61: 72.39,36.83 71.12,38.1 T42.1
N$11
  Bottom 1.27: T43.1 T45.1
N$12
  Bottom 1.27: T46.1 T48.1
N$13
  Bottom 1.27: T49.1 R7.1
N$14
  Bottom 1.27: T44.1 R6.1
N$15
  Bottom 0.61: Q1.2 50.67,12.7 50.8,12.7 IC1.13 50.8,24.29 C2.1
N$16
  Bottom 0.61: Q1.1 48.26,15.11 IC1.12 48.69,18.21 C1.1
PA0
  Bottom 1.27: IC1.40 T1.1
PA1
  Bottom 1.27: IC1.39 T2.1
PA2
  Bottom 1.27: IC1.38 T3.1
PA3
  Bottom 1.27: IC1.37 T4.1
PA4
  Bottom 1.27: IC1.36 T5.1
PA5
  Bottom 1.27: IC1.35 T6.1
PA6
  Bottom 1.27: IC1.34 T7.1
PA7
  Bottom 1.27: IC1.33 T8.1
PB0
  Bottom 1.27: IC1.1 T9.1 R4.1
PB1
  Bottom 1.27: R3.1 T10.1 IC1.2
PB2
  Bottom 1.27: R2.1 T11.1 IC1.3
PB3
  Bottom 1.27: R1.1 T12.1 IC1.4
PB4
  Bottom 1.27: D1.C T13.1 IC1.5
PB5
  Bottom 0.61: IC1.6 33.02,20.32 10.16,20.32 10.16,25.4 JP2.4
  Bottom 1.27: D2.C T14.1 IC1.6
PB6
  Bottom 0.254: 35.56,19.05 IC1.7
  Bottom 0.61: 35.56,19.05 35.56,20.32 33.02,22.86 JP2.1
  Bottom 1.27: D3.C T15.1 IC1.7
PB7
  Bottom 0.61: IC1.8 38.1,20.32 33.02,25.4 JP2.3
  Bottom 1.27: IC1.8 T16.1 D4.C
PC0
  Bottom 1.27: IC1.22 T17.1
PC1
  Bottom 1.27: IC1.23 T18.1
PC2
  Bottom 0.61: IC1.24 60.96,30.48 JP3.1
  Bottom 1.27: IC1.24 T19.1
PC3
  Bottom 0.406: 73.67,25.36 73.66,25.37 JP3.5 72.39,26.67 72.39,27.04 70.23,29.2 | 59.7,29.2 59.69,29.21 59.69,29.22
  Bottom 0.61: 70.23,29.2 59.7,29.2 | 59.69,29.22 58.42,30.49 IC1.25
  Bottom 1.27: IC1.25 T20.1
PC4
  Bottom 0.406: JP3.3 73.82,27.94 74.92,26.84 74.92,24.73 74.33,24.14 72.24,24.14 71.06,25.32 71.06,26.68 69.82,27.92 58.36,27.92 55.81,30.47 | 55.81,32.97 55.88,33.04
  Bottom 0.61: 55.81,30.47 55.81,32.97
  Bottom 1.27: IC1.26 55.88,33.04 T21.1
PC5
  Bottom 0.406: 73.74,20.32 73.75,20.31 | 73.74,20.32 JP3.9 | 73.74,20.32 69.93,24.13 69.93,26.12 69.19,26.86 57.93,26.86 | 53.23,33.04 53.25,33.02 | 53.25,33.02 IC1.27 | 53.3,31.49 53.3,32.97 53.25,33.02
  Bottom 0.61: 57.93,26.86 53.3,31.49
  Bottom 1.27: IC1.27 T22.1
PC6
  Bottom 1.27: IC1.28 T23.1
PC7
  Bottom 1.27: IC1.29 T24.1
PD0
  Bottom 1.27: T25.1 IC1.14
PD1
  Bottom 1.27: T26.1 IC1.15
PD2
  Bottom 0.406: 58.42,21.59 C6.1 T27.1
  Bottom 1.27: T27.1 IC1.16
PD3
  Bottom 1.27: IC1.17 T28.1 R6.2
PD4
  Bottom 1.27: IC1.18 T29.1 R7.2
PD5
  Bottom 1.27: T30.1 IC1.19
PD6
  Bottom 1.27: T31.1 IC1.20
PD7
  Bottom 0.254: 72.39,34.29 R5.1
  Bottom 0.61: 68.58,34.29 72.39,34.29
  Bottom 1.27: IC1.21 68.58,34.29 T32.1
RESET
  Bottom 0.254: IC1.9 40.64,19.05
  Bottom 0.406: 76.2,25.42 JP3.6 76.2,24.76 74.9,23.46 74.9,19.5 74.85,19.5 74.38,19.03 72.76,19.03 72.33,19.46 72.33,20.54 72.17,20.54 69.85,22.86 53.34,22.86 52.07,21.59 52.07,12.39 48.57,8.89 41.92,8.89 41.89,8.92 41.87,8.92 40.63,10.16 | IC1.9 40.61,17.81
  Bottom 0.61: 40.63,10.16 IC1.9 | 40.64,19.05 40.64,20.32 38.1,22.86 38.1,26.67 R8.2
  Bottom 0.813: 38.1,26.67 36.83,27.94 JP2.5
VCC  (via drill 0.6)  (26 unrouted)
  Top 0.406: T313.1 v45.7,48.26
  Bottom 0.406: 73.61,39.13 73.61,39.15 T41.3 | 74.97,31.56 74.97,29.17 | T53.1 | JP2.2 13.97,24.13 13.97,30.48 15.24,31.75 | T318.1 T317.1 T322.1 | T325.1 T350.1 | T354.1 T355.1 | 40.64,26.67 R8.1
  Bottom 0.61: 73.61,39.13 75.46,39.13 76.32,38.27 76.32,38.1 76.32,33.01 75.05,31.74 75.05,31.64 74.97,31.56 | T56.1 IC1.10 43.18,19.77 | 33.16,29.79 17.19,29.79 15.24,31.74 15.24,31.75 15.24,36.83 T344.1 15.24,48.17 15.26,48.19 40.57,48.19 T313.1 T51.1 T53.1 | 74.97,29.17 JP3.4 | 42.09,25.57 41.73,25.57 | 40.64,29.79 40.65,29.8 | 37.86,29.8 37.95,29.8 37.98,29.77 38.01,29.8
  Bottom 0.813: 45.73,48.23 v45.7,48.26 77.75,48.27 77.72,38.04 77.84,38.05 76.32,38.1 | 43.18,19.77 43.18,19.96 42.34,20.8 42.34,21.77 42.36,21.79 42.32,21.83 C3.1 42.32,24.58 42.29,24.61 C4.1 42.29,25.37 42.09,25.57 | 33.16,29.79 33.16,29.94 33.18,29.96 33.34,29.8 37.86,29.8 | 42.09,25.57 41.91,25.4 | 42.28,26.67 42.28,25.77 42.09,25.57 | 42.28,26.67 C5.1 | 42.28,26.67 40.64,26.67 | 41.73,25.57 40.64,26.67 | 40.64,26.67 40.64,29.79 | 40.65,29.8 38.01,29.8

### Text on the board
Top: DB | KB | RXD | TXD | VCC | GND
tPlace: GND | VCC | VCC | GND